# Altium schematic sheet Canaux.SchDoc
size A
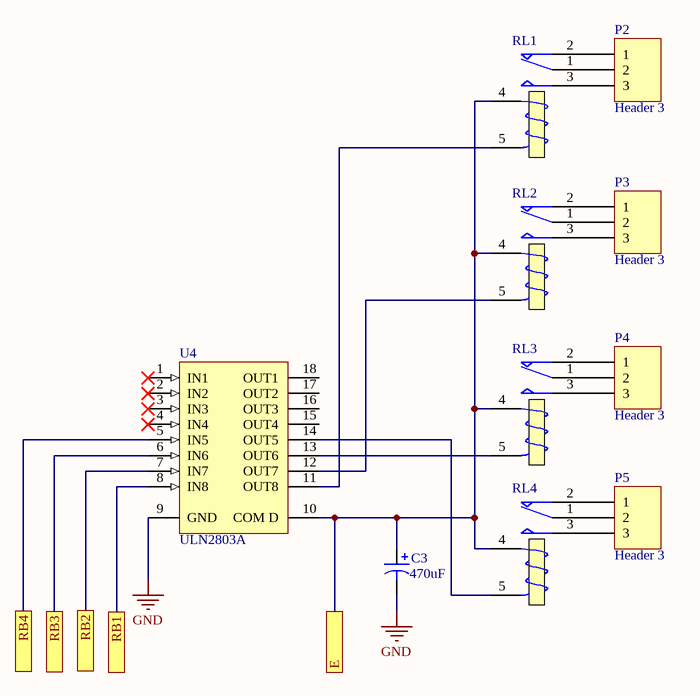
[diagram p0: Canaux.SchDoc]

## Parts
C3  value 470uF  [RB7.6-15]  (hidden comment: Cap Pol1)
P2  Header 3  [HDR1X3]
P3  Header 3  [HDR1X3]
P4  Header 3  [HDR1X3]
P5  Header 3  [HDR1X3]
RL1  Relay  [MODULE5B]  (value not drawn)
RL2  Relay  [MODULE5B]  (value not drawn)
RL3  Relay  [MODULE5B]  (value not drawn)
RL4  Relay  [MODULE5B]  (value not drawn)
U4  ULN2803A  [A18]

## Ports
E, RB1, RB2, RB3, RB4

## Nets
GND: C3.2 U4.9(GND)
E: C3.1 RL1.4(T1) RL2.4(T1) RL3.4(T1) RL4.4(T1) U4.10(COM_D) ; port E
RB1: U4.8(IN8) ; port RB1
RB2: U4.7(IN7) ; port RB2
RB3: U4.6(IN6) ; port RB3
RB4: U4.5(IN5) ; port RB4
NetP2_1: P2.1 RL1.2(NC)
NetP2_2: P2.2 RL1.1(COM)
NetP2_3: P2.3 RL1.3(NO)
NetP3_1: P3.1 RL2.2(NC)
NetP3_2: P3.2 RL2.1(COM)
NetP3_3: P3.3 RL2.3(NO)
NetP4_1: P4.1 RL3.2(NC)
NetP4_2: P4.2 RL3.1(COM)
NetP4_3: P4.3 RL3.3(NO)
NetP5_1: P5.1 RL4.2(NC)
NetP5_2: P5.2 RL4.1(COM)
NetP5_3: P5.3 RL4.3(NO)
NetRL1_5: RL1.5(T2) U4.11(OUT8)
NetRL2_5: RL2.5(T2) U4.12(OUT7)
NetRL3_5: RL3.5(T2) U4.13(OUT6)
NetRL4_5: RL4.5(T2) U4.14(OUT5)

Not connected (* = marked no-connect by the designer): U4 1(IN1)* 2(IN2)* 3(IN3)* 4(IN4)* 15(OUT4) 16(OUT3) 17(OUT2) 18(OUT1)

## Library data of the parts
C3 = Cap Pol1: Polarized Capacitor (Radial); Published: 8-Jun-2000; LatestRevisionDate: 17-Jul-2002; LatestRevisionNote: Re-released for DXP Platform.; PackageReference: RB7.6-15; Publisher: Altium Limited; PackageDescription: Polarized Capacitor (Radial); 2 Leads
P2-P5 = Header 3: Header, 3-Pin; LatestRevisionDate: 17-Jul-2002; LatestRevisionNote: Re-released for DXP Platform.; Publisher: Altium Limited
RL1-RL4 = Relay: SPDT Relay; Published: 8-Jun-2000; LatestRevisionDate: 17-Jul-2002; LatestRevisionNote: Re-released for DXP Platform.; PackageReference: MODULE5B; Publisher: Altium Limited
U4 = ULN2803A: High-Voltage, High-Current Darlington Array; Published: 13-Oct-2000; LatestRevisionDate: 06-Jun-2005; LatestRevisionNote: Stylized 3D Model Added.; DatasheetVersion: 1999; PackageVersion: 1999; PackageReference: A18; Publisher: Altium Limited; PackageDescription: DIP; 18 Leads; Row Spacing 7.62 mm; Pitch 2.54 mm; ComponentLink1Description: Manufacturer Link; ComponentLink1URL: http://www.allegromicro.com/